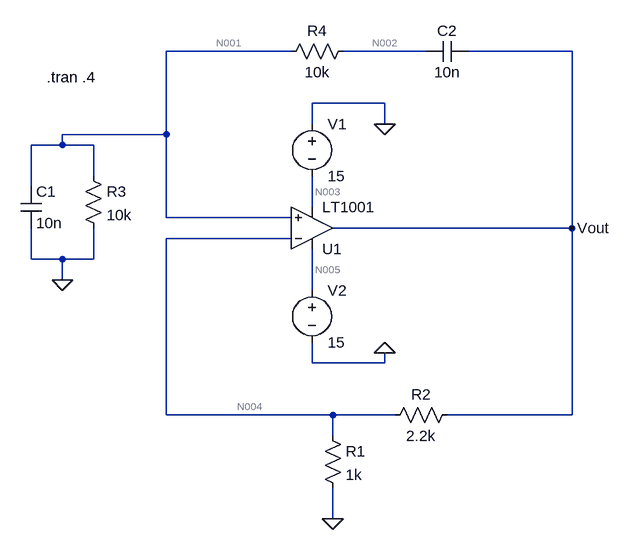
[diagram p0: schematic Wien Bridge Oscillator (Op-Amp).asc]
Wien Bridge Oscillator (Op-Amp).asc, the LTspice schematic file:
Version 4
SHEET 1 1124 680
WIRE 192 -592 0 -592
WIRE 400 -592 272 -592
WIRE 624 -592 464 -592
WIRE 336 -512 224 -512
WIRE 224 -480 224 -512
WIRE 336 -480 336 -512
WIRE 0 -464 0 -592
WIRE 0 -464 -160 -464
WIRE -160 -448 -160 -464
WIRE -160 -448 -208 -448
WIRE -112 -448 -160 -448
WIRE -112 -400 -112 -448
WIRE -208 -384 -208 -448
WIRE 224 -352 224 -400
WIRE 0 -336 0 -464
WIRE 192 -336 0 -336
WIRE 624 -320 624 -592
WIRE 624 -320 256 -320
WIRE 192 -304 0 -304
WIRE -208 -272 -208 -320
WIRE -160 -272 -208 -272
WIRE -112 -272 -112 -320
WIRE -112 -272 -160 -272
WIRE -160 -240 -160 -272
WIRE 224 -224 224 -288
WIRE 224 -112 224 -144
WIRE 336 -112 336 -128
WIRE 336 -112 224 -112
WIRE 0 -32 0 -304
WIRE 256 -32 0 -32
WIRE 352 -32 256 -32
WIRE 624 -32 624 -320
WIRE 624 -32 432 -32
WIRE 256 0 256 -32
WIRE 256 128 256 80
FLAG 336 -480 0
FLAG 336 -128 0
FLAG 256 128 0
FLAG -160 -240 0
FLAG 624 -320 Vout
SYMBOL OpAmps\\LT1001 224 -256 M180
SYMATTR InstName U1
SYMBOL voltage 224 -496 R0
SYMATTR InstName V1
SYMATTR Value 15
SYMBOL voltage 224 -240 R0
SYMATTR InstName V2
SYMATTR Value 15
SYMBOL res 240 -16 R0
SYMATTR InstName R1
SYMATTR Value 1k
SYMBOL res 448 -48 R90
WINDOW 0 0 56 VBottom 2
WINDOW 3 32 56 VTop 2
SYMATTR InstName R2
SYMATTR Value 2.2k
SYMBOL res -128 -416 R0
SYMATTR InstName R3
SYMATTR Value 10k
SYMBOL res 288 -608 R90
WINDOW 0 0 56 VBottom 2
WINDOW 3 32 56 VTop 2
SYMATTR InstName R4
SYMATTR Value 10k
SYMBOL cap -224 -384 R0
SYMATTR InstName C1
SYMATTR Value 10n
SYMBOL cap 464 -608 R90
WINDOW 0 0 32 VBottom 2
WINDOW 3 32 32 VTop 2
SYMATTR InstName C2
SYMATTR Value 10n
TEXT -184 -552 Left 2 !.tran .4

The netlist it stands for:
* Wien Bridge Oscillator (Op-Amp).asc
XU1 N001 N004 N005 N003 Vout LT1001  ; pins In+ In- V+ V- OUT
V1 0 N003 15
V2 N005 0 15
R1 N004 0 1k
R2 Vout N004 2.2k
R3 N001 0 10k
R4 N002 N001 10k
C1 N001 0 10n
C2 Vout N002 10n
.tran .4
.lib LTC.lib
.backanno
.end

* Results of the author's LTspice run, read from the files saved beside the schematic
* Operating Point, zero values left out:
*   V(n005) = 15 V
*   V(n003) = -15 V
*   I(V2) = -2.25 mA
*   I(V1) = -2.25 mA
*   Ix(u1:3) = 2.25 mA
*   Ix(u1:4) = -2.25 mA
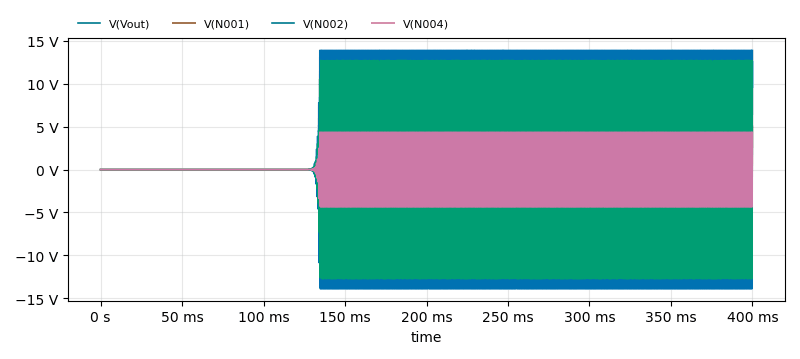
[diagram p1: Transient Analysis of Wien Bridge Oscillator (Op-Amp).asc, plotted from the saved traces]
* Transient Analysis, 1 run:
*   V(Vout): min -13.9 V, max 13.9 V, average 676.4 µV, rms 8.927 V, last 13.9 V
*   V(N001): min -5.047 V, max 5.047 V, average 247.1 µV, rms 2.963 V, last 4.71 V
*   V(N002): min -12.74 V, max 12.74 V, average 1.571 mV, rms 6.621 V, last 8.184 V
*   V(N004): min -4.345 V, max 4.345 V, average 211.4 µV, rms 2.79 V, last 4.344 V